# Altium schematic sheet USB To UART Converter.SchDoc
size A; SheetNumber: 17; SheetTotal: 19
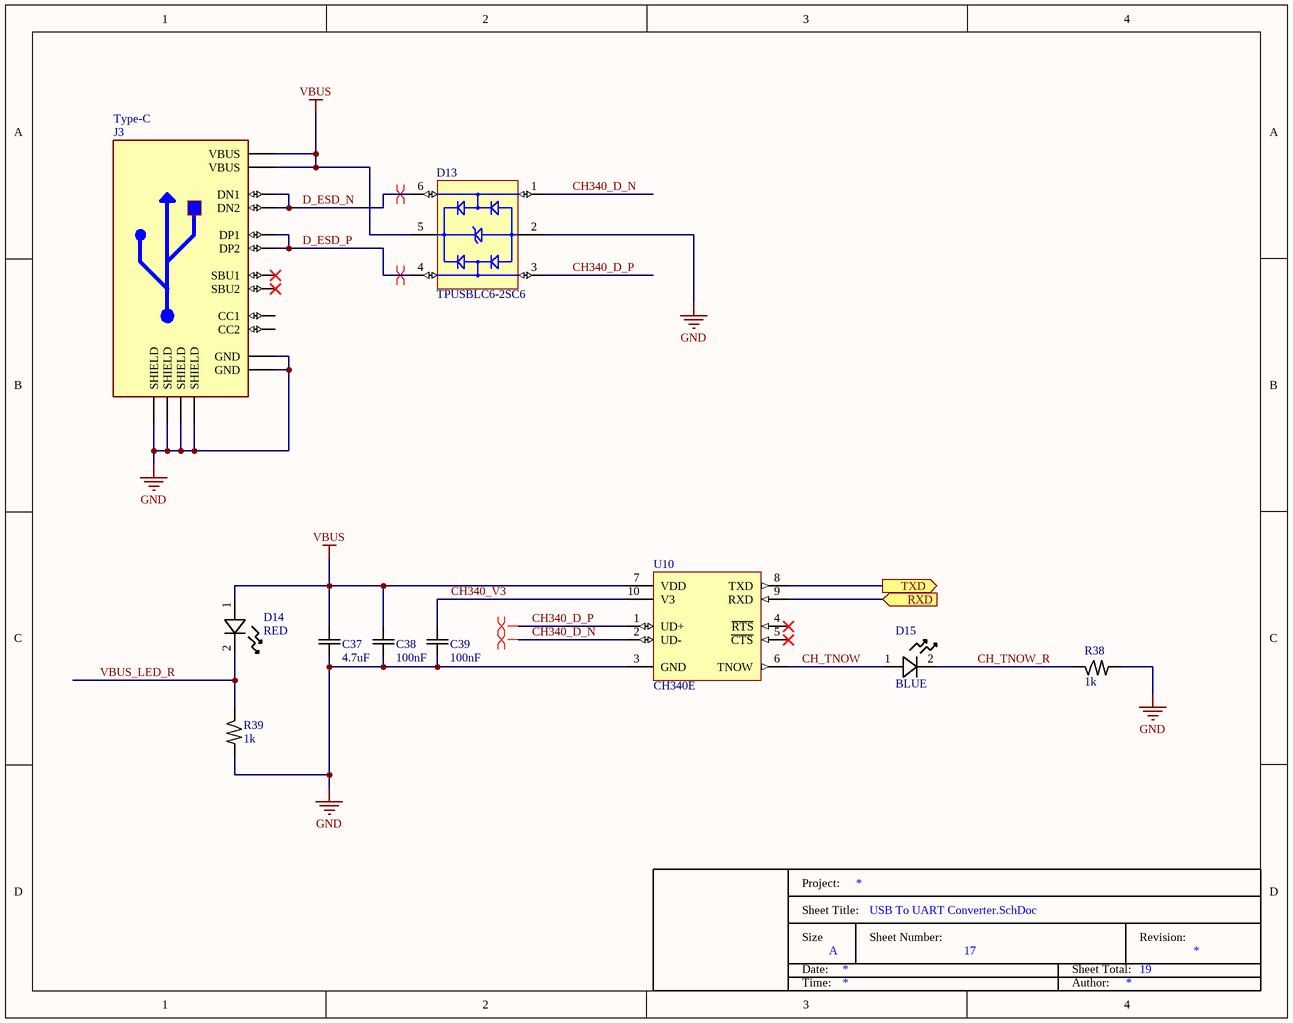
[diagram p0: USB To UART Converter.SchDoc]

## Parts
C37  4.7uF  [C0603]
C38  100nF  [C0603]
C39  100nF  [C0603]
D13  TPUSBLC6-2SC6  [SOT23-6]
D14  RED  [LED0805 RED]
D15  BLUE  [LED0805 BLUE]
J3  Type-C  [USB Type-C 16-Pin SMD]
R38  1k  [R0603]
R39  1k  [R0603]
U10  CH340E  [MSOP-10-NO EP]

## Ports
RXD (in), TXD (out)

## Nets
GND: C37.1 C38.1 C39.1 D13.2(GND) J3.A1_B12(GND) J3.B1_A12(GND) J3.S1(SHIELD) J3.S2(SHIELD) J3.S3(SHIELD) J3.S4(SHIELD) R38.1 R39.1 U10.3(GND)
VBUS: C37.2 C38.2 D13.5(VBUS) D14.1 J3.A4_B9(VBUS) J3.B4_A9(VBUS) U10.7(VDD)
CH340_D_N: D13.1(I/O1) U10.2(UD-)
CH340_D_P: D13.3(I/O2) U10.1(UD+)
CH340_V3: C39.2 U10.10(V3)
CH_TNOW: D15.1 U10.6(TNOW)
CH_TNOW_R: D15.2 R38.2
D_ESD_N: D13.6(I/O1) J3.A7(DN1) J3.B7(DN2)
D_ESD_P: D13.4(I/O2) J3.A6(DP1) J3.B6(DP2)
RXD: U10.9(RXD) ; port RXD
TXD: U10.8(TXD) ; port TXD
VBUS_LED_R: D14.2 R39.2

Not connected (* = marked no-connect by the designer): J3 A5(CC1) A8(SBU1)* B5(CC2) B8(SBU2)*; U10 4(~{RTS})* 5(~{CTS})*

## Layout directives
differential pair; net class USB: CH340_D_N, CH340_D_P, D_ESD_N, D_ESD_P

## Notes on the sheet
- Project:
- Sheet Title:
- Size
- Date:
- A
- Sheet Number:
- Sheet Total:
- Revision:
- Time:
- Author:

## Library data of the parts
C37 = Cap_cer: 10V 4.7uF X7R ±10% 0603 Ceramic Capacitors ROHS; MF: Chinocera; MP: HGC0603R7475K100NTHJ; ComponentLink1Description: Datasheet; ComponentLink1URL: *; ComponentLink2Description: Supplier1; ComponentLink2URL: https://www.lcsc.com/product-detail/C49333234.html?s_z=n_HGC0603R7475K100NTHJ
C38 C39 = Cap_cer: CAP CER 100nF 50V X7R 0603; MF: HRE; MP: CGA0603X7R104K500JT; ComponentLink1Description: Datasheet; ComponentLink1URL: https://www.lcsc.com/datasheet/C6119867.pdf; ComponentLink2Description: Supplier1; ComponentLink2URL: https://www.lcsc.com/product-detail/C6119867.html
D13 = TPUSBLC6-2SC6: ESD DIODE 5VWM 15VC SOT-23-6; MF: TECH PUBLIC; ComponentLink1Description: Datasheet; ComponentLink1URL: https://www.lcsc.com/datasheet/C558442.pdf; ComponentLink2Description: Supplier1; ComponentLink2URL: https://www.lcsc.com/product-detail/C558442.html?s_z=n_C558442; MP: TPUSBLC6-2SC6
D14 = LED: LED RED WATER CLEAR 0805 SMD; MF: XINGLIGHT; MP: XL-TD2012SURC; ComponentLink1Description: Datasheet; ComponentLink1URL: https://www.lcsc.com/datasheet/C5349939.pdf; ComponentLink2Description: Supplier1; ComponentLink2URL: https://www.lcsc.com/product-detail/C5349939.html
D15 = LED: 20mA 500mcd~1200mcd 470nm Top-mount Blue 70mW 2.7V~3.2V 0805 LED Indication - Discrete RoHS; MF: XINGLIGHT; MP: XL-TD2012UBC; ComponentLink1Description: Datasheet; ComponentLink1URL: https://www.lcsc.com/datasheet/C5349940.pdf; ComponentLink2Description: Supplier1; ComponentLink2URL: https://www.lcsc.com/product-detail/C5349940.html
J3 = USB Type-C 16-Pin SMD: CONN RCPT Type-C 16POS SMD R/A; MF: DEALON; MP: USB-TYPE-C-019; ComponentLink1Description: Datasheet; ComponentLink1URL: https://www.lcsc.com/datasheet/C2927039.pdf; ComponentLink2Description: Supplier1; ComponentLink2URL: https://www.lcsc.com/product-detail/C2927039.html?s_z=n_C2927039
R38 R39 = Res: RES 1kΩ ±5% 100mW 0603; MF: VO; MP: SCR0603J1K; ComponentLink1Description: Datasheet; ComponentLink1URL: https://www.lcsc.com/datasheet/C3017736.pdf; ComponentLink2Description: Supplier1; ComponentLink2URL: https://www.lcsc.com/product-detail/C3017736.html
U10 = CH340E: USB to Serial Port Chip CH340; MF: WCH; ComponentLink1Description: Datasheet; ComponentLink1URL: https://www.lcsc.com/datasheet/C99652.pdf; ComponentLink2Description: Supplier1; ComponentLink2URL: https://www.lcsc.com/product-detail/C99652.html?s_z=n_ch340; MP: CH340E